# Altium schematic sheet LrAc.SchDoc
size A2 portrait
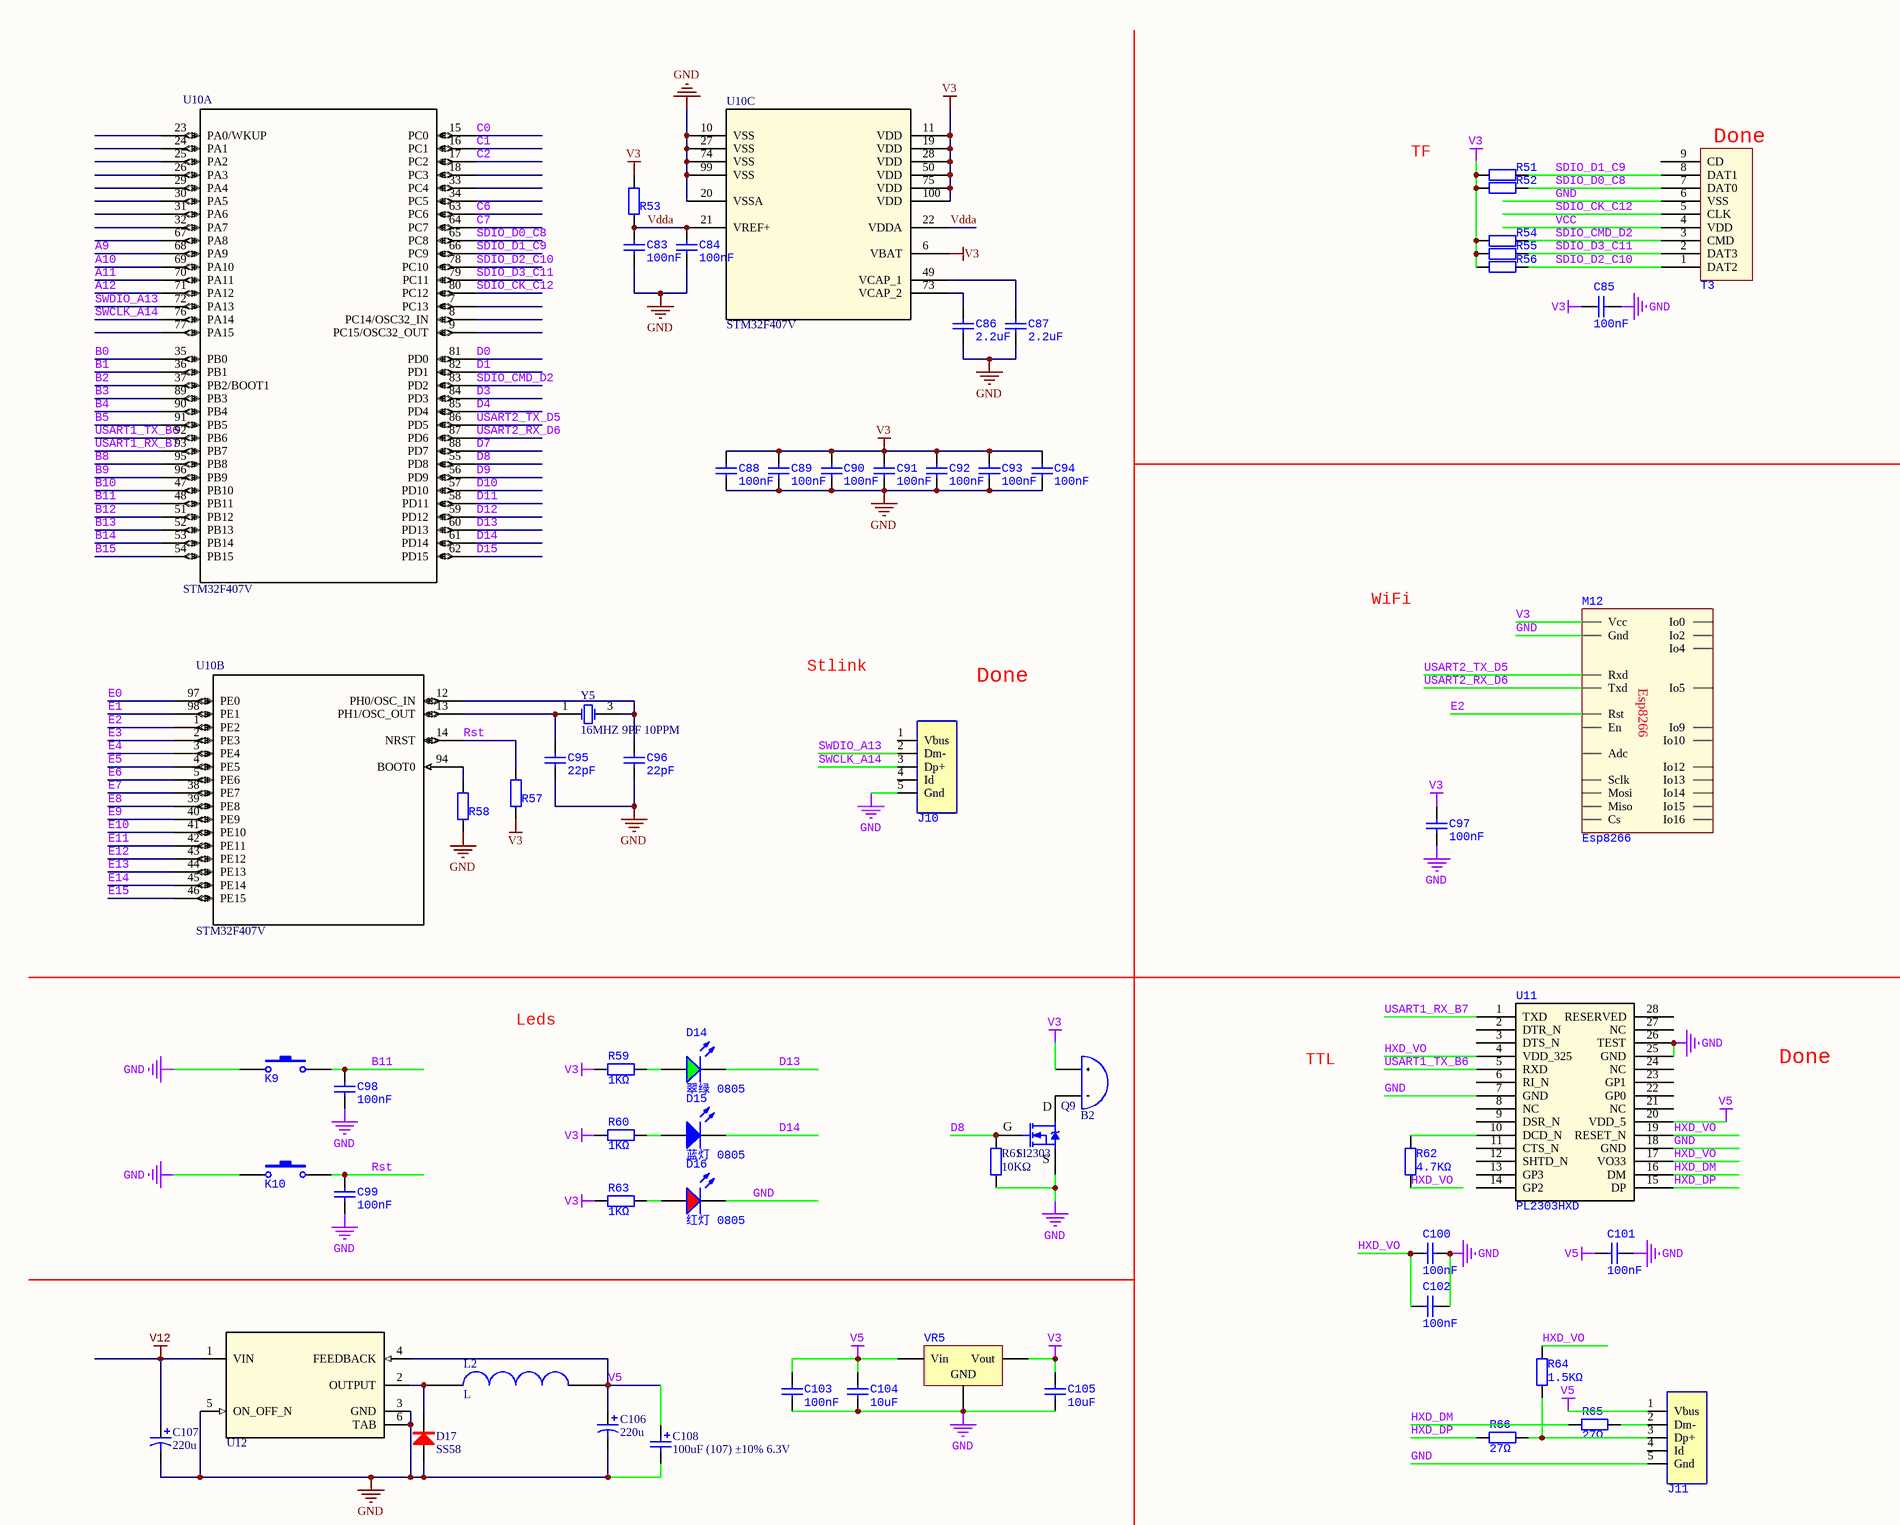
[diagram p0: LrAc.SchDoc, top]
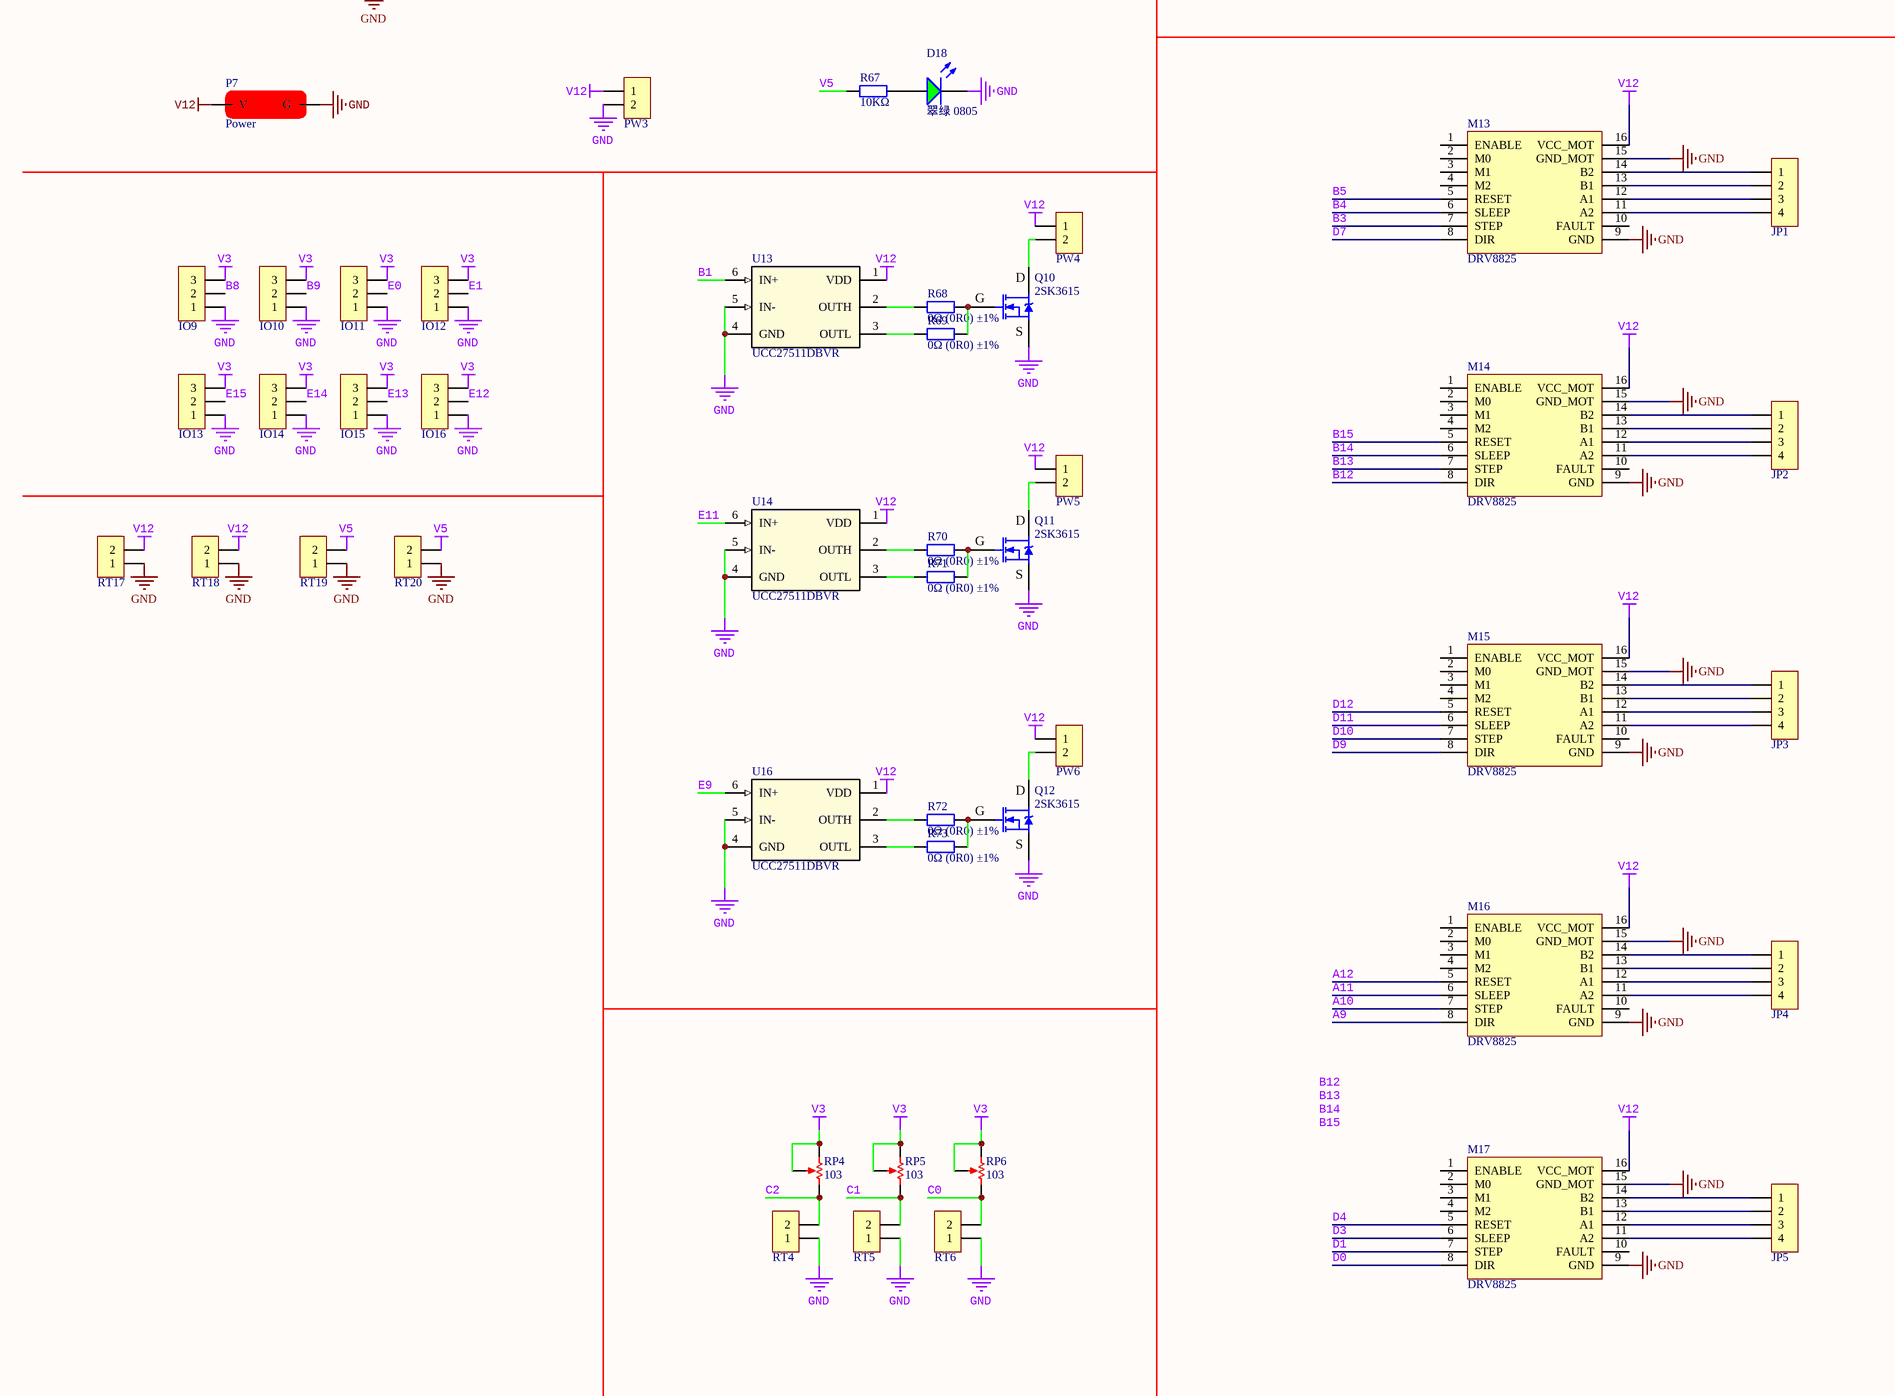
[diagram p1: LrAc.SchDoc, bottom]

## Parts
B2  Bell  [BELL11.9]  (value not drawn)
C83  100nF  [0603_C]
C84  100nF  [0603_C]
C85  100nF  [0603_C]
C86  2.2uF  [0603_C]
C87  2.2uF  [0603_C]
C88  100nF  [0603_C]
C89  100nF  [0603_C]
C90  100nF  [0603_C]
C91  100nF  [0603_C]
C92  100nF  [0603_C]
C93  100nF  [0603_C]
C94  100nF  [0603_C]
C95  22pF  [0603_C]
C96  22pF  [0603_C]
C97  100nF  [0603_C]
C98  100nF  [0603_C]
C99  100nF  [0603_C]
C100  100nF  [0603_C]
C101  100nF  [0603_C]
C102  100nF  [0603_C]
C103  100nF  [0603_C]
C104  10uF  [0805_C]
C105  10uF  [0805_C]
C106  220u  [CM F(10*10.2)]
C107  220u  [CM F(10*10.2)]
C108  100uF (107) ±10% 6.3V  [CASE-B_3528]
D14  翠绿 0805  [0805_LED_S1]
D15  蓝灯 0805  [0805_LED_S1]
D16  红灯 0805  [0805_LED_S1]
D17  SS58  [SMA]
D18  翠绿 0805  [0805_LED_S1]
IO9  HDR-1X3  [XH2.54-LI-3P]  (value not drawn)
IO10  HDR-1X3  [XH2.54-LI-3P]  (value not drawn)
IO11  HDR-1X3  [XH2.54-LI-3P]  (value not drawn)
IO12  HDR-1X3  [XH2.54-LI-3P]  (value not drawn)
IO13  HDR-1X3  [XH2.54-LI-3P]  (value not drawn)
IO14  HDR-1X3  [XH2.54-LI-3P]  (value not drawn)
IO15  HDR-1X3  [XH2.54-LI-3P]  (value not drawn)
IO16  HDR-1X3  [XH2.54-LI-3P]  (value not drawn)
J10  UsbOtg  [USB-MINI-A]  (value not drawn)
J11  UsbOtg  [USB-MICRO_E]  (value not drawn)
JP1  HDR-1X4  [XH2.54-LI-4P]  (value not drawn)
JP2  HDR-1X4  [XH2.54-LI-4P]  (value not drawn)
JP3  HDR-1X4  [XH2.54-LI-4P]  (value not drawn)
JP4  HDR-1X4  [XH2.54-LI-4P]  (value not drawn)
JP5  HDR-1X4  [XH2.54-LI-4P]  (value not drawn)
K9  SW  [SWITCH]  (value not drawn)
K10  SW  [SWITCH]  (value not drawn)
L2  L  [CDRH127]
M12  Esp8266  [ESP8266]
M13  DRV8825  [DRV8825]
M14  DRV8825  [DRV8825]
M15  DRV8825  [DRV8825]
M16  DRV8825  [DRV8825]
M17  DRV8825  [DRV8825]
P7  Power  [DC-005]
PW3  HDR-1X2  [2PIN-5.08A]  (value not drawn)
PW4  HDR-1X2  [2PIN-5.08A]  (value not drawn)
PW5  HDR-1X2  [2PIN-5.08A]  (value not drawn)
PW6  HDR-1X2  [2PIN-5.08A]  (value not drawn)
Q9  SI2303  [SI2302]
Q10  2SK3615  [IRF3205]
Q11  2SK3615  [IRF3205]
Q12  2SK3615  [IRF3205]
R51  47KΩ  [0603_R]  (value not drawn)
R52  47KΩ  [0603_R]  (value not drawn)
R53  10Ω  [0603_R]  (value not drawn)
R54  47KΩ  [0603_R]  (value not drawn)
R55  47KΩ  [0603_R]  (value not drawn)
R56  47KΩ  [0603_R]  (value not drawn)
R57  47KΩ  [0603_R]  (value not drawn)
R58  47KΩ  [0603_R]  (value not drawn)
R59  1KΩ  [0603_R]
R60  1KΩ  [0603_R]
R61  10KΩ  [0805_R]
R62  4.7KΩ  [0603_R]
R63  1KΩ  [0603_R]
R64  1.5KΩ  [0603_R]
R65  27Ω  [0603_R]
R66  27Ω  [0603_R]
R67  10KΩ  [0805_R]
R68  0Ω (0R0) ±1%  [0805_R]
R69  0Ω (0R0) ±1%  [0805_R]
R70  0Ω (0R0) ±1%  [0805_R]
R71  0Ω (0R0) ±1%  [0805_R]
R72  0Ω (0R0) ±1%  [0805_R]
R73  0Ω (0R0) ±1%  [0805_R]
RP4  103  [RP3362P]
RP5  103  [RP3362P]
RP6  103  [RP3362P]
RT4  HDR-1X2  [XH2.54-LI-2P]  (value not drawn)
RT5  HDR-1X2  [XH2.54-LI-2P]  (value not drawn)
RT6  HDR-1X2  [XH2.54-LI-2P]  (value not drawn)
RT17  HDR-1X2  [XH2.54-LI-2P]  (value not drawn)
RT18  HDR-1X2  [XH2.54-LI-2P]  (value not drawn)
RT19  HDR-1X2  [XH2.54-LI-2P]  (value not drawn)
RT20  HDR-1X2  [XH2.54-LI-2P]  (value not drawn)
T3  TFCard  [TF-CARD]  (value not drawn)
U10  STM32F407V  [LQFP100]  (parts A,B,C of 3)
U11  PL2303HXD  [SSOP28]
U12  LM2596  [TO263]  (value not drawn)
U13  UCC27511DBVR  [DBV0006A_N]
U14  UCC27511DBVR  [DBV0006A_N]
U16  UCC27511DBVR  [DBV0006A_N]
VR5  AMS1117-3.3  [SOT-223]  (value not drawn)
Y5  16MHZ 9PF 10PPM  [SMD-3225_4P]

## Nets
GND: C83.1 C84.1 C85.2 C86.1 C87.1 C88.1 C89.1 C90.1 C91.1 C92.1 C93.1 C94.1 C95.1 C96.1 C97.1 C98.1 C99.1 C100.1 C101.1 C102.1 C103.1 C104.1 C105.1 C106.2 C107.2 C108.2 D16.K D17.1(A) D18.K IO9.1 IO10.1 IO11.1 IO12.1 IO13.1 IO14.1 IO15.1 IO16.1 J10.5(Gnd) J11.5(Gnd) K9.1 K10.1 M12.15(Gnd) M13.9(GND) M13.15(GND_MOT) M14.9(GND) M14.15(GND_MOT) M15.9(GND) M15.15(GND_MOT) M16.9(GND) M16.15(GND_MOT) M17.9(GND) M17.15(GND_MOT) P7.2(G) PW3.2 Q9.3(S) Q10.3(S) Q11.3(S) Q12.3(S) R58.1 R61.1 RT4.1 RT5.1 RT6.1 RT17.1 RT18.1 RT19.1 RT20.1 T3.6(VSS) U10.10(VSS) U10.20(VSSA) U10.27(VSS) U10.74(VSS) U10.99(VSS) U11.7(GND) U11.18(GND) U11.25(GND) U11.26(TEST) U12.3(GND) U12.5(ON_OFF_N) U12.6(TAB) U13.4(GND) U13.5(IN-) U14.4(GND) U14.5(IN-) U16.4(GND) U16.5(IN-) VR5.1(GND)
V3: B2.1(A) C85.1 C88.2 C89.2 C90.2 C91.2 C92.2 C93.2 C94.2 C97.2 C105.2 IO9.3 IO10.3 IO11.3 IO12.3 IO13.3 IO14.3 IO15.3 IO16.3 M12.8(Vcc) R51.1 R52.1 R53.2 R54.1 R55.1 R56.1 R57.1 R59.2 R60.2 R63.2 RP4.2(TAP) RP4.3(TOP) RP5.2(TAP) RP5.3(TOP) RP6.2(TAP) RP6.3(TOP) U10.6(VBAT) U10.11(VDD) U10.19(VDD) U10.28(VDD) U10.50(VDD) U10.75(VDD) U10.100(VDD) VR5.2(Vout)
V5: C101.2 C103.2 C104.2 C106.1 C108.1 J11.1(Vbus) L2.2 R67.1 RT19.2 RT20.2 U11.20(VDD_5) U12.4(FEEDBACK) VR5.3(Vin)
V12: C107.1 M13.16(VCC_MOT) M14.16(VCC_MOT) M15.16(VCC_MOT) M16.16(VCC_MOT) M17.16(VCC_MOT) P7.1(V) PW3.1 PW4.1 PW5.1 PW6.1 RT17.2 RT18.2 U12.1(VIN) U13.1(VDD) U14.1(VDD) U16.1(VDD)
A9: M16.8(DIR) U10.68(PA9)
A10: M16.7(STEP) U10.69(PA10)
A11: M16.6(SLEEP) U10.70(PA11)
A12: M16.5(RESET) U10.71(PA12)
B0: U10.35(PB0)
B1: U10.36(PB1) U13.6(IN+)
B2: U10.37(PB2/BOOT1)
B3: M13.7(STEP) U10.89(PB3)
B4: M13.6(SLEEP) U10.90(PB4)
B5: M13.5(RESET) U10.91(PB5)
B8: IO9.2 U10.95(PB8)
B9: IO10.2 U10.96(PB9)
B10: U10.47(PB10)
B11: C98.2 K9.2 U10.48(PB11)
B12: M14.8(DIR) U10.51(PB12)
B13: M14.7(STEP) U10.52(PB13)
B14: M14.6(SLEEP) U10.53(PB14)
B15: M14.5(RESET) U10.54(PB15)
C0: RP6.1(BOT) RT6.2 U10.15(PC0)
C1: RP5.1(BOT) RT5.2 U10.16(PC1)
C2: RP4.1(BOT) RT4.2 U10.17(PC2)
C6: U10.63(PC6)
C7: U10.64(PC7)
D0: M17.8(DIR) U10.81(PD0)
D1: M17.7(STEP) U10.82(PD1)
D3: M17.6(SLEEP) U10.84(PD3)
D4: M17.5(RESET) U10.85(PD4)
D7: M13.8(DIR) U10.88(PD7)
D8: Q9.1(G) R61.2 U10.55(PD8)
D9: M15.8(DIR) U10.56(PD9)
D10: M15.7(STEP) U10.57(PD10)
D11: M15.6(SLEEP) U10.58(PD11)
D12: M15.5(RESET) U10.59(PD12)
D13: D14.K U10.60(PD13)
D14: D15.K U10.61(PD14)
D15: U10.62(PD15)
E0: IO11.2 U10.97(PE0)
E1: IO12.2 U10.98(PE1)
E2: M12.1(Rst) U10.1(PE2)
E3: U10.2(PE3)
E4: U10.3(PE4)
E5: U10.4(PE5)
E6: U10.5(PE6)
E7: U10.38(PE7)
E8: U10.39(PE8)
E9: U10.40(PE9) U16.6(IN+)
E10: U10.41(PE10)
E11: U10.42(PE11) U14.6(IN+)
E12: IO16.2 U10.43(PE12)
E13: IO15.2 U10.44(PE13)
E14: IO14.2 U10.45(PE14)
E15: IO13.2 U10.46(PE15)
HXD_DM: R65.1 U11.16(DM)
HXD_DP: R66.1 U11.15(DP)
HXD_VO: C100.2 C102.2 R62.2 R64.2 U11.4(VDD_325) U11.17(VO33) U11.19(RESET_N)
Rst: C99.2 K10.2 R57.2 U10.14(NRST)
SDIO_CK_C12: T3.5(CLK) U10.80(PC12)
SDIO_CMD_D2: R54.2 T3.3(CMD) U10.83(PD2)
SDIO_D0_C8: R52.2 T3.7(DAT0) U10.65(PC8)
SDIO_D1_C9: R51.2 T3.8(DAT1) U10.66(PC9)
SDIO_D2_C10: R56.2 T3.1(DAT2) U10.78(PC10)
SDIO_D3_C11: R55.2 T3.2(DAT3) U10.79(PC11)
SWCLK_A14: J10.3(Dp+) U10.76(PA14)
SWDIO_A13: J10.2(Dm-) U10.72(PA13)
USART1_RX_B7: U10.93(PB7) U11.1(TXD)
USART1_TX_B6: U10.92(PB6) U11.5(RXD)
USART2_RX_D6: M12.22(Txd) U10.87(PD6)
USART2_TX_D5: M12.21(Rxd) U10.86(PD5)
VCC: T3.4(VDD)
Vdda: C83.2 C84.2 R53.1 U10.21(VREF+) U10.22(VDDA)
NetB2_2: B2.2(B) Q9.2(D)
NetC86_2: C86.2 U10.73(VCAP_2)
NetC87_2: C87.2 U10.49(VCAP_1)
NetC95_2: C95.2 U10.13(PH1/OSC_OUT) Y5.1(OSC1)
NetC96_2: C96.2 U10.12(PH0/OSC_IN) Y5.3(OSC2)
NetD14_A: D14.A R59.1
NetD15_A: D15.A R60.1
NetD16_A: D16.A R63.1
NetD17_2: D17.2(K) L2.1 U12.2(OUTPUT)
NetD18_A: D18.A R67.2
NetJ11_2: J11.2(Dm-) R65.2
NetJ11_3: J11.3(Dp+) R64.1 R66.2
NetJP1_1: JP1.1 M13.14(B2)
NetJP1_2: JP1.2 M13.13(B1)
NetJP1_3: JP1.3 M13.12(A1)
NetJP1_4: JP1.4 M13.11(A2)
NetJP2_1: JP2.1 M14.14(B2)
NetJP2_2: JP2.2 M14.13(B1)
NetJP2_3: JP2.3 M14.12(A1)
NetJP2_4: JP2.4 M14.11(A2)
NetJP3_1: JP3.1 M15.14(B2)
NetJP3_2: JP3.2 M15.13(B1)
NetJP3_3: JP3.3 M15.12(A1)
NetJP3_4: JP3.4 M15.11(A2)
NetJP4_1: JP4.1 M16.14(B2)
NetJP4_2: JP4.2 M16.13(B1)
NetJP4_3: JP4.3 M16.12(A1)
NetJP4_4: JP4.4 M16.11(A2)
NetJP5_1: JP5.1 M17.14(B2)
NetJP5_2: JP5.2 M17.13(B1)
NetJP5_3: JP5.3 M17.12(A1)
NetJP5_4: JP5.4 M17.11(A2)
NetPW4_2: PW4.2 Q10.2(D)
NetPW5_2: PW5.2 Q11.2(D)
NetPW6_2: PW6.2 Q12.2(D)
NetQ10_1: Q10.1(G) R68.2 R69.2
NetQ11_1: Q11.1(G) R70.2 R71.2
NetQ12_1: Q12.1(G) R72.2 R73.2
NetR58_2: R58.2 U10.94(BOOT0)
NetR62_1: R62.1 U11.10(DCD_N)
NetR68_1: R68.1 U13.2(OUTH)
NetR69_1: R69.1 U13.3(OUTL)
NetR70_1: R70.1 U14.2(OUTH)
NetR71_1: R71.1 U14.3(OUTL)
NetR72_1: R72.1 U16.2(OUTH)
NetR73_1: R73.1 U16.3(OUTL)

Not connected (* = marked no-connect by the designer): J10 1(Vbus) 4(Id); J11 4(Id); M12 2(Adc) 3(En) 4(Io16) 5(Io14) 6(Io12) 7(Io13) 9(Sclk) 10(Mosi) 11(Io10) 12(Io9) 13(Miso) 14(Cs) 16(Io15) 17(Io2) 18(Io0) 19(Io4) 20(Io5); M13 1(ENABLE) 2(M0) 3(M1) 4(M2) 10(FAULT); M14 1(ENABLE) 2(M0) 3(M1) 4(M2) 10(FAULT); M15 1(ENABLE) 2(M0) 3(M1) 4(M2) 10(FAULT); M16 1(ENABLE) 2(M0) 3(M1) 4(M2) 10(FAULT); M17 1(ENABLE) 2(M0) 3(M1) 4(M2) 10(FAULT); T3 9(CD); U10 7(PC13) 8(PC14/OSC32_IN) 9(PC15/OSC32_OUT) 18(PC3) 23(PA0/WKUP) 24(PA1) 25(PA2) 26(PA3) 29(PA4) 30(PA5) 31(PA6) 32(PA7) 33(PC4) 34(PC5) 67(PA8) 77(PA15); U11 2(DTR_N) 3(DTS_N) 6(RI_N) 8(NC) 9(DSR_N) 11(CTS_N) 12(SHTD_N) 13(GP3) 14(GP2) 21(NC) 22(GP0) 23(GP1) 24(NC) 27(NC) 28(RESERVED)

## Notes on the sheet
- TF
- (near T3) Done
- WiFi
- Stlink
- Done
- Leds
- TTL
- Labels drawn without touching a wire or pin: B12, B13, B14, B15
- Title
- Size:
- Date:
- File:
- A2
- Number:
- Time:
- Revision:
- Sheet
- of

## Library data of the parts
B2 = Bell: 蜂鸣器
C83-C103 = 0603 100nF (104) 10% 50V: 贴片电容; ComponentLink1Description: 供应商链接; ComponentLink1URL: http://www.szlcsc.com/product/details_15331.html; Package: 0603; Supplier: LC; SuppliersPartNumber: C14663
C104 C105 = 0805 10uF (106) 10% 25V: 贴片电容; ComponentLink1Description: 供应商链接; ComponentLink1URL: http://www.szlcsc.com/product/details_16532.html; Package: 0805; Supplier: LC; SuppliersPartNumber: C15850
C106 C107 = Cp: Polarized Capacitor (Axial); Published: 8-Jun-2000; LatestRevisionDate: 17-Jul-2002; LatestRevisionNote: Re-released for DXP Platform.; PackageReference: POLAR0.8; Publisher: Altium Limited; PackageDescription: Polarized Capacitor; 2 Leads
C108 = 3528 100uF (107) 10% 6.3V: 钽电容; ComponentLink1Description: 供应商链接; ComponentLink1URL: http://www.szlcsc.com/product/details_16815.html; Package: 3528; Supplier: LC; SuppliersPartNumber: C16133
D14 D18 = 0805 翠绿: 发光二极管; ComponentLink1Description: 供应商链接; ComponentLink1URL: http://www.szlcsc.com/product/details_2670.html; Package: 0805; Supplier: LC; SuppliersPartNumber: C2297
D15 = 0805 蓝灯: 发光二极管; ComponentLink1Description: 供应商链接; ComponentLink1URL: http://www.szlcsc.com/product/details_2666.html; Package: 0805; Supplier: LC; SuppliersPartNumber: C2293
D16 = 0805 红灯: 发光二极管; ComponentLink1Description: 供应商链接; ComponentLink1URL: http://www.szlcsc.com/product/details_2668.html; Package: 0805; Supplier: LC; SuppliersPartNumber: C2295
D17 = Dz: 整流二极管; 版权归属: 源创客; BOM名称: 整流二极管; 学习资源: www.ooocke.com
IO9-IO16 = Header 3: 3P接插件; 版权归属: 源创客; BOM名称: 3P接插件; 学习资源: www.ooocke.com
JP1-JP5 = Header 4: 4P接插件; 版权归属: 源创客; BOM名称: 4P接插件; 学习资源: www.ooocke.com
K9 K10 = SW: Switch
M13-M17 = DRV8825: 步进电机驱动模块; 版权归属: 源创客; BOM名称: 步进电机驱动模块; 学习资源: www.ooocke.com
PW3-PW6 RT4-RT6 RT17-RT20 = Header 2: 2P接插件; 版权归属: 源创客; BOM名称: 2P接插件; 学习资源: www.ooocke.com
Q9-Q12 = NMOS: N沟场效应管; 版权归属: 源创客; BOM名称: N沟场效应管; 学习资源: www.ooocke.com
R51-R58 = 0603 47KΩ (4702) 1%: 贴片电阻; ComponentLink1Description: 供应商链接; ComponentLink1URL: http://www.szlcsc.com/product/details_26562.html; Package: 0603; Supplier: LC; SuppliersPartNumber: C25819
R59 R60 R62-R66 = 0603 10KΩ (1002) 1%: 贴片电阻; ComponentLink1Description: 供应商链接; ComponentLink1URL: http://www.szlcsc.com/product/details_26547.html; Package: 0603; Supplier: LC; SuppliersPartNumber: C25804
R61 R67 = 0805 10KΩ (1002) 1%: 贴片电阻; ComponentLink1Description: 供应商链接; ComponentLink1URL: http://www.szlcsc.com/product/details_18102.html; Package: 0805; Supplier: LC; SuppliersPartNumber: C17414
R68-R73 = 0805 0Ω (0R0) 1%: 贴片电阻; ComponentLink1Description: 供应商链接; ComponentLink1URL: http://www.szlcsc.com/product/details_18165.html; Package: 0805; Supplier: LC; SuppliersPartNumber: C17477
RP4-RP6 = Rp: Potentiometer; Sim Note: Enter the Resistance value and the set point into parameter fields.; Set Position: 0.5; Published: 8-Jun-2000; LatestRevisionDate: 17-Jul-2002; LatestRevisionNote: Re-released for DXP Platform.; PackageReference: VR5; Publisher: Altium Limited; PackageDescription: Variable Resistor, Thru-Hole; 3 Leads
U10 = STM32F407V: Imported; Manufacturer_Part_Number: stm32f4xxv2; Vendor: STMicroelectronics; C: Copyright (C) 2016 Accelerated Designs. All rights reserved; Copyright: Copyright (C) 2016 Accelerated Designs. All rights reserved; RefDes: RefDes; Type: Type; Value: Value
U11 = PL2303HXD: Driver; Manufacturer_Part_Number: tlc5916-q1_d_16; GENERIC_PART_NUMBER: TLC5916-Q1; Vendor: Texas Instruments; PACKAGE_DESIGNATOR: D; PIN_COUNT: 16; FAMILY_NAME: LED DRIVER; INDUSTRY_STD_PKG_TYPE: SOIC; Manufacturer: Texas Instruments; Datasheet_URL: http://www.ti.com/lit/gpn/TLC5916-Q1; Value: Value; Type: Type; RefDes: RefDes
U12 = LM2596: Imported; PartNumber: LM2596SX-ADJ/NOPB; Alternate_PartNumber: LM2596S-ADJ/NOPB; Manufacturer: Texas Instruments; CompType: IC; PIN_COUNT: 6; PackageReference: KTT0005B; MountType: SMT; RoHS: Y; RefDes: RefDes; TYPE: TYPE; Value: Value
U13 U14 U16 = UCC27511DBVR: Imported; Alternate_PartNumber: UCC27511DBVT; Manufacturer: Texas Instruments; CompType: IC; PIN_COUNT: 6; PartNumber: UCC27511DBVR; PackageReference: DBV0006A; MountType: SMT; RoHS: Y; RefDes: RefDes; TYPE: TYPE; Value: Value
VR5 = SOT-223 AMS1117-3.3: 低压差线性稳压(LDO); ComponentLink1Description: 供应商链接; ComponentLink1URL: http://www.szlcsc.com/product/details_6652.html; Package: SOT-223; Supplier: LC; SuppliersPartNumber: C6186
Y5 = SMD-3225_4P  16MHZ 9PF 10PPM: 贴片晶振; ComponentLink1Description: 供应商链接; ComponentLink1URL: http://www.szlcsc.com/product/details_14393.html; Package: SMD-3225_4P; Supplier: LC; SuppliersPartNumber: C13738